# Altium schematic sheet Sheet3.SchDoc
size B
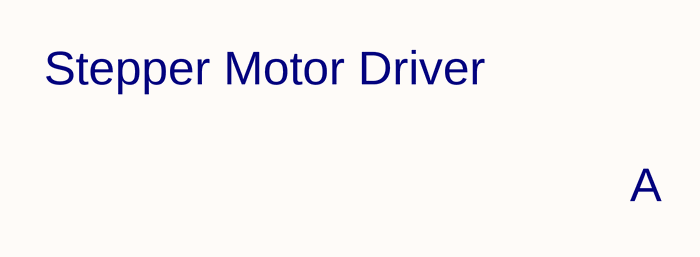
[diagram p0: Sheet3.SchDoc]

## Notes on the sheet
- Stepper Motor Driver
- A